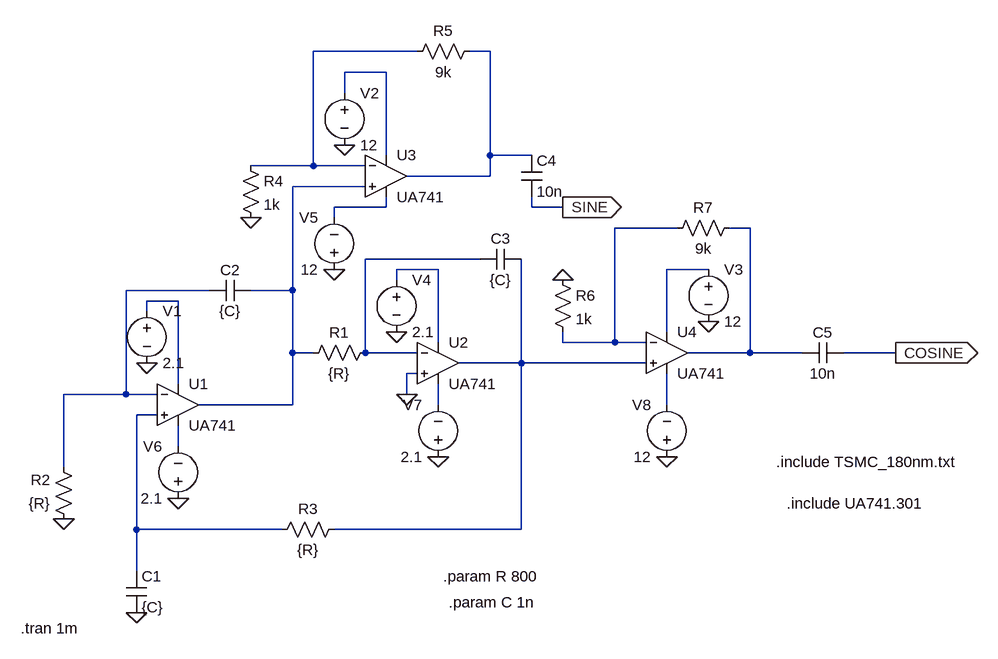
[diagram p0: schematic final_circuit.asc]
final_circuit.asc, the LTspice schematic file:
Version 4
SHEET 1 880 680
WIRE -48 -400 -208 -400
WIRE 64 -400 32 -400
WIRE -96 -368 -160 -368
WIRE -160 -336 -160 -368
WIRE -96 -240 -96 -368
WIRE 64 -240 64 -400
WIRE 128 -240 64 -240
WIRE -208 -224 -208 -400
WIRE -208 -224 -304 -224
WIRE -128 -224 -208 -224
WIRE 64 -208 64 -240
WIRE 64 -208 -64 -208
WIRE -128 -192 -240 -192
WIRE -96 -160 -96 -176
WIRE -96 -160 -176 -160
WIRE 128 -160 128 -176
WIRE 176 -160 128 -160
WIRE -176 -144 -176 -160
WIRE 352 -128 256 -128
WIRE 464 -128 432 -128
WIRE 48 -80 -128 -80
WIRE -16 -64 -80 -64
WIRE 400 -64 336 -64
WIRE -80 -48 -80 -64
WIRE -368 -32 -496 -32
WIRE -240 -32 -240 -192
WIRE -240 -32 -304 -32
WIRE -416 -16 -464 -16
WIRE -464 0 -464 -16
WIRE 336 32 336 -64
WIRE -16 48 -16 -64
WIRE 176 48 176 32
WIRE 256 48 256 -128
WIRE 256 48 176 48
WIRE 304 48 256 48
WIRE -240 64 -240 -32
WIRE -208 64 -240 64
WIRE -128 64 -128 -80
WIRE -48 64 -128 64
WIRE 464 64 464 -128
WIRE 464 64 368 64
WIRE 544 64 464 64
WIRE 688 64 608 64
WIRE 112 80 112 -80
WIRE 112 80 16 80
WIRE 304 80 112 80
WIRE -48 96 -64 96
WIRE -416 112 -416 -16
WIRE -496 128 -496 -32
WIRE -496 128 -592 128
WIRE -448 128 -496 128
WIRE -64 128 -64 96
WIRE -240 144 -240 64
WIRE -240 144 -384 144
WIRE -16 144 -16 112
WIRE 336 144 336 96
WIRE -448 160 -480 160
WIRE -416 208 -416 176
WIRE -592 240 -592 128
WIRE -480 336 -480 160
WIRE -256 336 -480 336
WIRE 112 336 112 80
WIRE 112 336 -176 336
WIRE -480 400 -480 336
FLAG -304 -144 0
FLAG 176 -48 0
FLAG 688 64 COSINE
IOPIN 688 64 Out
FLAG -480 464 0
FLAG -592 320 0
FLAG -64 128 0
FLAG -160 -256 0
FLAG -176 -64 0
FLAG -80 32 0
FLAG -16 224 0
FLAG 400 16 0
FLAG 336 224 0
FLAG -464 80 0
FLAG -416 288 0
FLAG 176 -160 SINE
IOPIN 176 -160 Out
SYMBOL res -112 48 R90
WINDOW 0 0 56 VBottom 2
WINDOW 3 32 56 VTop 2
SYMATTR InstName R1
SYMATTR Value {R}
SYMBOL res -576 336 R180
WINDOW 0 36 76 Left 2
WINDOW 3 36 40 Left 2
SYMATTR InstName R2
SYMATTR Value {R}
SYMBOL res -272 352 R270
WINDOW 0 32 56 VTop 2
WINDOW 3 0 56 VBottom 2
SYMATTR InstName R3
SYMATTR Value {R}
SYMBOL cap -496 400 R0
SYMATTR InstName C1
SYMATTR Value {C}
SYMBOL cap -304 -48 R90
WINDOW 0 0 32 VBottom 2
WINDOW 3 32 32 VTop 2
SYMATTR InstName C2
SYMATTR Value {C}
SYMBOL cap 112 -96 R90
WINDOW 0 0 32 VBottom 2
WINDOW 3 32 32 VTop 2
SYMATTR InstName C3
SYMATTR Value {C}
SYMBOL res -320 -240 R0
SYMATTR InstName R4
SYMATTR Value 1k
SYMBOL res 48 -416 R90
WINDOW 0 0 56 VBottom 2
WINDOW 3 32 56 VTop 2
SYMATTR InstName R5
SYMATTR Value 9k
SYMBOL cap 112 -240 R0
SYMATTR InstName C4
SYMATTR Value 10n
SYMBOL res 160 -64 R0
SYMATTR InstName R6
SYMATTR Value 1k
SYMBOL res 448 -144 R90
WINDOW 0 0 56 VBottom 2
WINDOW 3 32 56 VTop 2
SYMATTR InstName R7
SYMATTR Value 9k
SYMBOL cap 608 48 R90
WINDOW 0 0 32 VBottom 2
WINDOW 3 32 32 VTop 2
SYMATTR InstName C5
SYMATTR Value 10n
SYMBOL voltage -464 -16 R0
SYMATTR InstName V1
SYMATTR Value 2.1
SYMBOL voltage -160 -352 R0
SYMATTR InstName V2
SYMATTR Value 12
SYMBOL voltage 400 -80 R0
SYMATTR InstName V3
SYMATTR Value 12
SYMBOL voltage -80 -64 R0
WINDOW 123 0 0 Left 0
WINDOW 39 0 0 Left 0
SYMATTR InstName V4
SYMATTR Value 2.1
SYMBOL voltage -176 -48 R180
WINDOW 0 24 96 Left 2
WINDOW 3 24 16 Left 2
WINDOW 123 0 0 Left 0
WINDOW 39 0 0 Left 0
SYMATTR InstName V5
SYMATTR Value 12
SYMBOL voltage -416 304 R180
WINDOW 0 24 96 Left 2
WINDOW 3 24 16 Left 2
WINDOW 123 0 0 Left 0
WINDOW 39 0 0 Left 0
SYMATTR InstName V6
SYMATTR Value 2.1
SYMBOL voltage -16 240 R180
WINDOW 0 24 96 Left 2
WINDOW 3 24 16 Left 2
WINDOW 123 0 0 Left 0
WINDOW 39 0 0 Left 0
SYMATTR InstName V7
SYMATTR Value 2.1
SYMBOL voltage 336 240 R180
WINDOW 0 24 96 Left 2
WINDOW 3 24 16 Left 2
WINDOW 123 0 0 Left 0
WINDOW 39 0 0 Left 0
SYMATTR InstName V8
SYMATTR Value 12
SYMBOL OpAmps\\opamp2 -416 80 R0
SYMATTR InstName U1
SYMATTR Value UA741
SYMBOL OpAmps\\opamp2 -16 16 R0
SYMATTR InstName U2
SYMATTR Value UA741
SYMBOL OpAmps\\opamp2 -96 -272 R0
SYMATTR InstName U3
SYMATTR Value UA741
SYMBOL OpAmps\\opamp2 336 0 R0
SYMATTR InstName U4
SYMATTR Value UA741
TEXT -8 408 Left 2 !.param R 800
TEXT 0 448 Left 2 !.param C 1n
TEXT 504 232 Left 2 !.include TSMC_180nm.txt
TEXT 520 296 Left 2 !.include UA741.301
TEXT -658 488 Left 2 !.tran 1m

The netlist it stands for:
* final_circuit.asc
R1 N008 N004 {R}
R2 0 N011 {R}
R3 N016 N013 {R}
C1 N016 0 {C}
C2 N004 N011 {C}
C3 N013 N008 {C}
R4 N001 0 1k
R5 N002 N001 9k
C4 N002 SINE 10n
R6 0 N006 1k
R7 N007 N006 9k
C5 COSINE N007 10n
V1 N012 0 2.1
V2 N003 0 12
V3 N010 0 12
V4 N009 0 2.1
V5 0 N005 12
V6 0 N017 2.1
V7 0 N014 2.1
V8 0 N015 12
XU1 N016 N011 N012 N017 N004 UA741  ; pins In+ In- V+ V- OUT
XU2 0 N008 N009 N014 N013 UA741  ; pins In+ In- V+ V- OUT
XU3 N004 N001 N003 N005 N002 UA741  ; pins In+ In- V+ V- OUT
XU4 N013 N006 N010 N015 N007 UA741  ; pins In+ In- V+ V- OUT
.param R 800
.param C 1n
.include TSMC_180nm.txt
.include UA741.301
.tran 1m
.backanno
.end